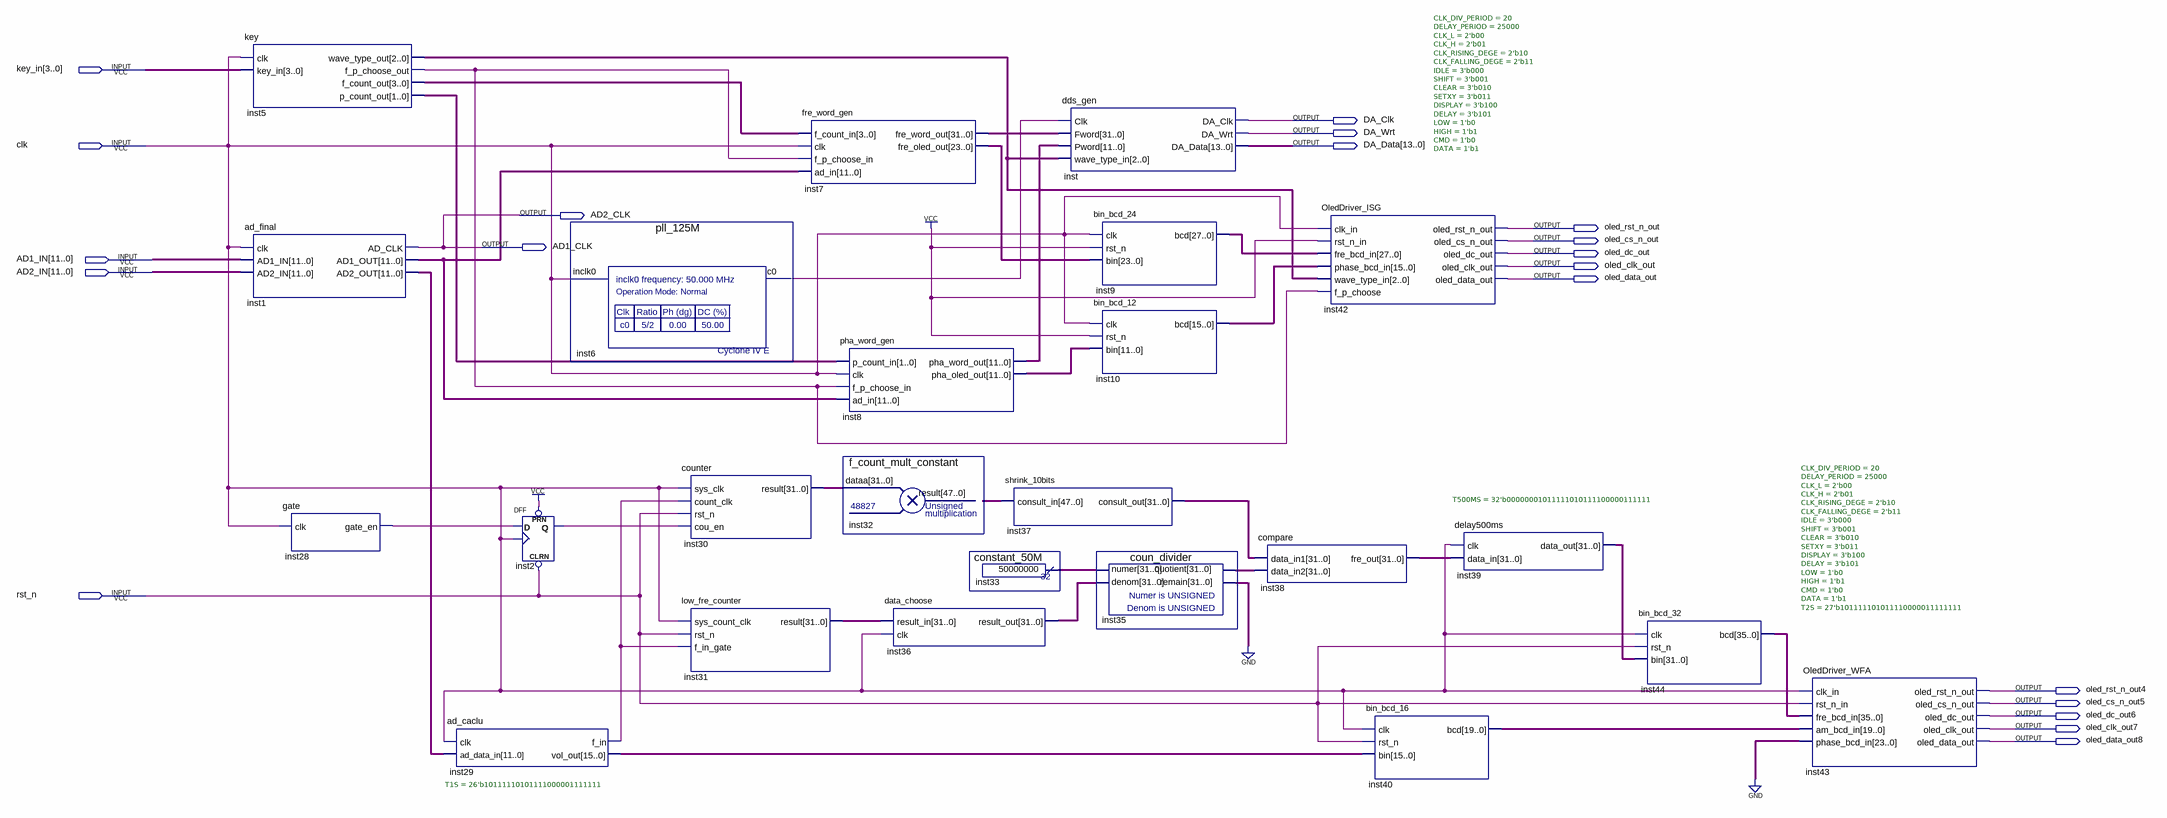
[diagram p0: schematic sheet]
// Quartus schematic ISG_WFA.bdf as structural Verilog: 24 symbols, 20 pins
module ISG_WFA (
  input  [3:0] key_in,
  input  clk,
  input  [11:0] AD1_IN,
  input  [11:0] AD2_IN,
  input  rst_n,
  output DA_Clk,
  output DA_Wrt,
  output [13:0] DA_Data,
  output AD2_CLK,
  output oled_rst_n_out,
  output oled_cs_n_out,
  output AD1_CLK,
  output oled_dc_out,
  output oled_clk_out,
  output oled_data_out,
  output oled_rst_n_out4,
  output oled_cs_n_out5,
  output oled_dc_out6,
  output oled_clk_out7,
  output oled_data_out8
);

  wire inst2_q, inst5_f_p_choose_out, inst6_c0, inst28_gate_en, inst29_f_in;
  wire [1:0] inst5_p_count_out;
  wire [2:0] inst5_wave_type_out;
  wire [3:0] inst5_f_count_out;
  wire [11:0] inst1_ad1_out, inst1_ad2_out, inst8_pha_oled_out, inst8_pha_word_out;
  wire [15:0] inst10_bcd, inst29_vol_out;
  wire [19:0] inst40_bcd;
  wire [23:0] inst7_fre_oled_out;
  wire [27:0] inst9_bcd;
  wire [31:0] inst7_fre_word_out, inst30_result, inst31_result, inst33_result, inst35_quotient,
       inst35_remain, inst36_result_out, inst37_consult_out, inst38_fre_out, inst39_data_out;
  wire [35:0] inst44_bcd;
  wire [47:0] inst32_result;

  key inst5 (
    .clk(clk), .key_in(key_in), .wave_type_out(inst5_wave_type_out), .f_p_choose_out(inst5_f_p_choose_out),
    .f_count_out(inst5_f_count_out), .p_count_out(inst5_p_count_out));
  ad_final inst1 (
    .clk(clk), .AD1_IN(AD1_IN), .AD2_IN(AD2_IN), .AD_CLK(AD1_CLK), .AD1_OUT(inst1_ad1_out),
    .AD2_OUT(inst1_ad2_out));
  gate inst28 (.clk(clk), .gate_en(inst28_gate_en));
  ad_caclu #(.T1S(26'b10111110101111000001111111)) inst29 (
    .clk(clk), .ad_data_in(inst1_ad2_out), .f_in(inst29_f_in), .vol_out(inst29_vol_out));
  DFF inst2 (.CLRN(rst_n), .CLK(clk), .D(inst28_gate_en), .PRN(1'b1), .Q(inst2_q));
  pll_125M inst6 (.inclk0(clk), .c0(inst6_c0));
  counter inst30 (.sys_clk(clk), .count_clk(inst29_f_in), .rst_n(rst_n), .cou_en(inst2_q), .result(inst30_result));
  low_fre_counter inst31 (.sys_count_clk(clk), .rst_n(rst_n), .f_in_gate(inst29_f_in), .result(inst31_result));
  fre_word_gen inst7 (
    .f_count_in(inst5_f_count_out), .clk(clk), .f_p_choose_in(inst5_f_p_choose_out), .ad_in(inst1_ad1_out),
    .fre_word_out(inst7_fre_word_out), .fre_oled_out(inst7_fre_oled_out));
  pha_word_gen inst8 (
    .p_count_in(inst5_p_count_out), .clk(clk), .f_p_choose_in(inst5_f_p_choose_out), .ad_in(inst1_ad1_out),
    .pha_word_out(inst8_pha_word_out), .pha_oled_out(inst8_pha_oled_out));
  f_count_mult_constant inst32 (.dataa(inst30_result), .result(inst32_result));
  data_choose inst36 (.result_in(inst31_result), .clk(clk), .result_out(inst36_result_out));
  constant_50M inst33 (.result(inst33_result));
  shrink_10bits inst37 (.consult_in(inst32_result), .consult_out(inst37_consult_out));
  dds_gen inst (
    .Clk(inst6_c0), .Fword(inst7_fre_word_out), .Pword(inst8_pha_word_out),
    .wave_type_in(inst5_wave_type_out), .DA_Clk(DA_Clk), .DA_Wrt(DA_Wrt), .DA_Data(DA_Data));
  bin_bcd_24 inst9 (.clk(clk), .rst_n(1'b1), .bin(inst7_fre_oled_out), .bcd(inst9_bcd));
  bin_bcd_12 inst10 (.clk(clk), .rst_n(1'b1), .bin(inst8_pha_oled_out), .bcd(inst10_bcd));
  coun_divider inst35 (
    .numer(inst33_result), .denom(inst36_result_out), .quotient(inst35_quotient), .remain(inst35_remain));
  compare inst38 (.data_in1(inst37_consult_out), .data_in2(inst35_quotient), .fre_out(inst38_fre_out));
  OledDriver_ISG #(.CLK_DIV_PERIOD(20), .DELAY_PERIOD(25000), .CLK_L(2'b00), .CLK_H(2'b01), .CLK_RISING_DEGE(2'b10), .CLK_FALLING_DEGE(2'b11), .IDLE(3'b000), .SHIFT(3'b001), .CLEAR(3'b010), .SETXY(3'b011), .DISPLAY(3'b100), .DELAY(3'b101), .LOW(1'b0), .HIGH(1'b1), .CMD(1'b0), .DATA(1'b1)) inst42 (
    .clk_in(clk), .rst_n_in(1'b1), .fre_bcd_in(inst9_bcd), .phase_bcd_in(inst10_bcd),
    .wave_type_in(inst5_wave_type_out), .f_p_choose(inst5_f_p_choose_out), .oled_rst_n_out(oled_rst_n_out),
    .oled_cs_n_out(oled_cs_n_out), .oled_dc_out(oled_dc_out), .oled_clk_out(oled_clk_out),
    .oled_data_out(oled_data_out));
  bin_bcd_16 inst40 (.clk(clk), .rst_n(rst_n), .bin(inst29_vol_out), .bcd(inst40_bcd));
  delay500ms #(.T500MS(32'b00000001011111010111100000111111)) inst39 (
    .clk(clk), .data_in(inst38_fre_out), .data_out(inst39_data_out));
  bin_bcd_32 inst44 (.clk(clk), .rst_n(rst_n), .bin(inst39_data_out), .bcd(inst44_bcd));
  OledDriver_WFA #(.CLK_DIV_PERIOD(20), .DELAY_PERIOD(25000), .CLK_L(2'b00), .CLK_H(2'b01), .CLK_RISING_DEGE(2'b10), .CLK_FALLING_DEGE(2'b11), .IDLE(3'b000), .SHIFT(3'b001), .CLEAR(3'b010), .SETXY(3'b011), .DISPLAY(3'b100), .DELAY(3'b101), .LOW(1'b0), .HIGH(1'b1), .CMD(1'b0), .DATA(1'b1), .T2S(27'b101111101011110000011111111)) inst43 (
    .clk_in(clk), .rst_n_in(rst_n), .fre_bcd_in(inst44_bcd), .am_bcd_in(inst40_bcd),
    .phase_bcd_in({24{1'b0}}), .oled_rst_n_out(oled_rst_n_out4), .oled_cs_n_out(oled_cs_n_out5),
    .oled_dc_out(oled_dc_out6), .oled_clk_out(oled_clk_out7), .oled_data_out(oled_data_out8));

  assign AD2_CLK = AD1_CLK;
  // also tied to GND on the sheet: {inst35_remain[0], inst35_remain[1], inst35_remain[2], inst35_remain[3], inst35_remain[4], inst35_remain[5], inst35_remain[6], inst35_remain[7], inst35_remain[8], inst35_remain[9], inst35_remain[10], inst35_remain[11], inst35_remain[12], inst35_remain[13], inst35_remain[14], inst35_remain[15], inst35_remain[16], inst35_remain[17], inst35_remain[18], inst35_remain[19], inst35_remain[20], inst35_remain[21], inst35_remain[22], inst35_remain[23], inst35_remain[24], inst35_remain[25], inst35_remain[26], inst35_remain[27], inst35_remain[28], inst35_remain[29], inst35_remain[30], inst35_remain[31]}
endmodule
